# Altium project jtag_ob.PrjPcb
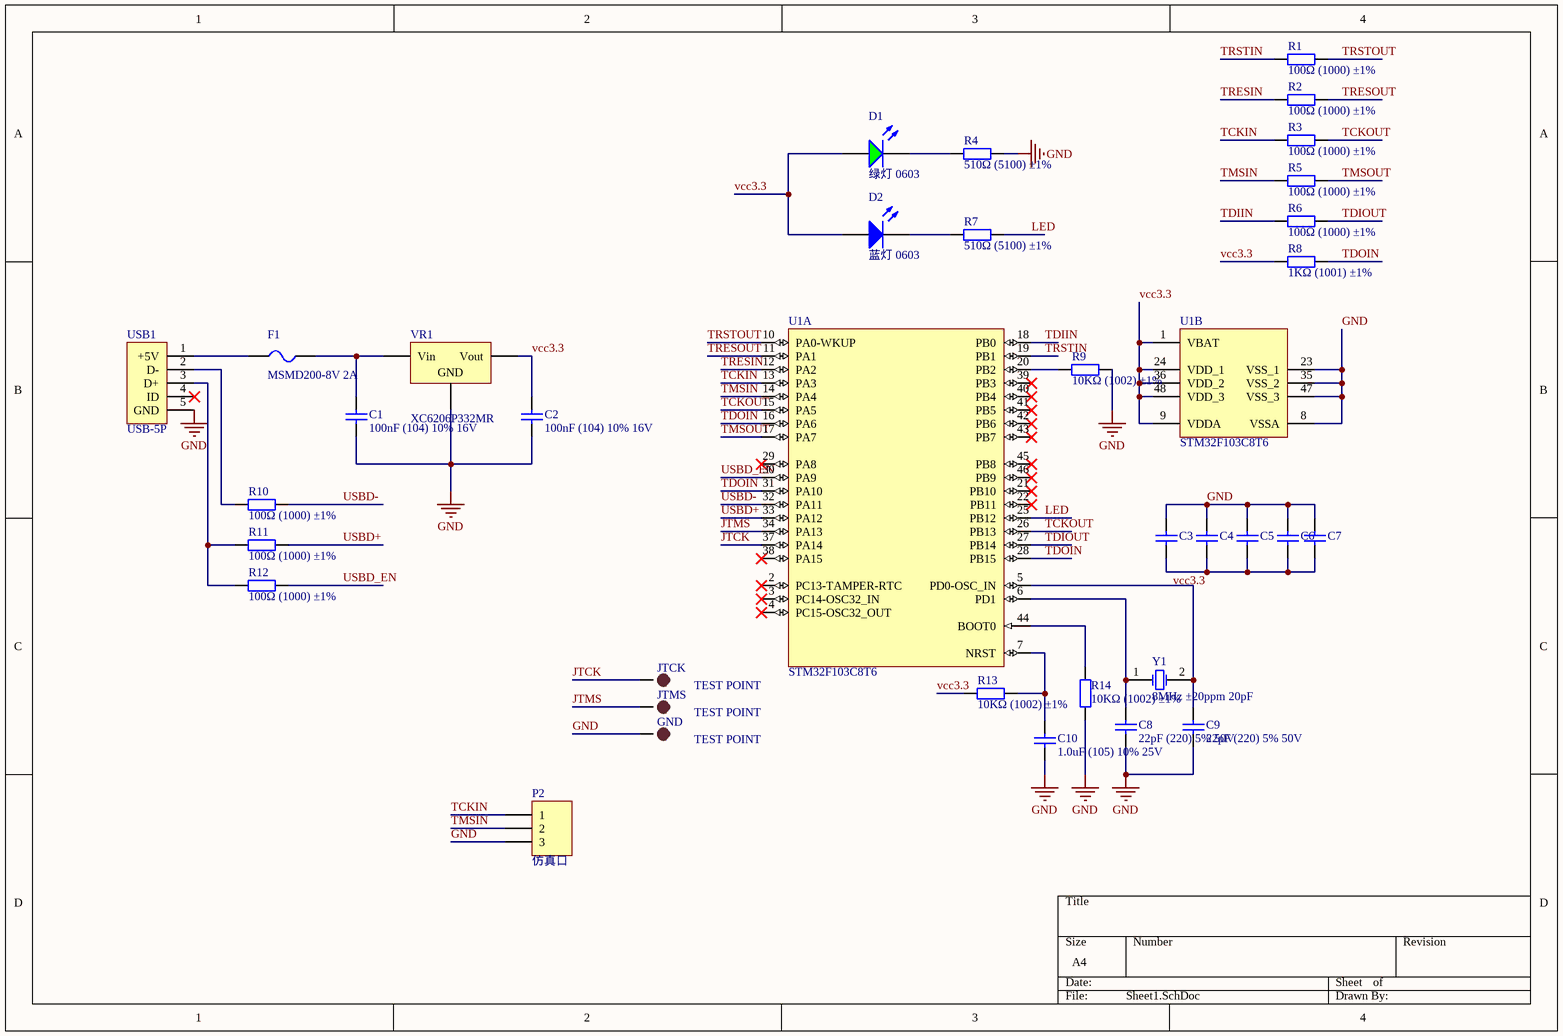
[diagram p0: Sheet1.SchDoc]
1 sheet, 35 parts. Net scope: global (net labels, ports and power ports of the same name join across sheets).
Board files: PCB1.PcbDoc, jlink_ob.PcbDoc

## Sheet Sheet1.SchDoc
size A4

### Parts
C1  100nF (104) 10% 16V  [0402_C]
C2  100nF (104) 10% 16V  [0402_C]
C3  100nF (104) 10% 16V  [0402_C]  (value not drawn)
C4  100nF (104) 10% 16V  [0402_C]  (value not drawn)
C5  100nF (104) 10% 16V  [0402_C]  (value not drawn)
C6  100nF (104) 10% 16V  [0402_C]  (value not drawn)
C7  100nF (104) 10% 16V  [0402_C]  (value not drawn)
C8  22pF (220) 5% 50V  [0402_C]
C9  22pF (220) 5% 50V  [0402_C]
C10  1.0uF (105) 10% 25V  [0402_C]
D1  绿灯 0603  [0603_LED_S1]
D2  蓝灯 0603  [0603_LED_S1]
F1  MSMD200-8V 2A  [FU 0805]
GND  TEST POINT  [TP-1.5]
JTCK  TEST POINT  [TP-1.5]
JTMS  TEST POINT  [TP-1.5]
P2  仿真口  [HDR1X3]
R1  100Ω (1000) ±1%  [0402_R]
R2  100Ω (1000) ±1%  [0402_R]
R3  100Ω (1000) ±1%  [0402_R]
R4  510Ω (5100) ±1%  [0603_R]
R5  100Ω (1000) ±1%  [0402_R]
R6  100Ω (1000) ±1%  [0402_R]
R7  510Ω (5100) ±1%  [0603_R]
R8  1KΩ (1001) ±1%  [0402_R]
R9  10KΩ (1002) ±1%  [0402_R]
R10  100Ω (1000) ±1%  [0402_R]
R11  100Ω (1000) ±1%  [0402_R]
R12  100Ω (1000) ±1%  [0402_R]
R13  10KΩ (1002) ±1%  [0402_R]
R14  10KΩ (1002) ±1%  [0402_R]
U1  STM32F103C8T6  [LQFP-48_7x7x05P]  (parts A,B of 2)
USB1  USB-5P  [USB-MICRO_A]
VR1  XC6206P332MR  [SOT-23-3L]
Y1  8MHz ±20ppm 20pF  [SMD-5032_2P]

### Nets
GND: C1.1 C2.1 C3.2 C4.2 C5.2 C6.2 C7.2 C8.1 C9.1 C10.1 GND.1 P2.3 R4.2 R9.2 R14.1 U1.8(VSSA) U1.23(VSS_1) U1.35(VSS_2) U1.47(VSS_3) USB1.5(GND) VR1.1(GND)
JTCK: JTCK.1 U1.37(PA14)
JTMS: JTMS.1 U1.34(PA13)
LED: R7.2 U1.25(PB12)
TCKIN: P2.1 R3.1 U1.13(PA3)
TCKOUT: R3.2 U1.15(PA5) U1.26(PB13)
TDIIN: R6.1 U1.18(PB0)
TDIOUT: R6.2 U1.27(PB14)
TDOIN: R8.2 U1.16(PA6) U1.28(PB15) U1.31(PA10)
TMSIN: P2.2 R5.1 U1.14(PA4)
TMSOUT: R5.2 U1.17(PA7)
TRESIN: R2.1 U1.12(PA2)
TRESOUT: R2.2 U1.11(PA1)
TRSTIN: R1.1 U1.19(PB1)
TRSTOUT: R1.2 U1.10(PA0-WKUP)
USBD+: R11.2 U1.33(PA12)
USBD-: R10.2 U1.32(PA11)
USBD_EN: R12.2 U1.30(PA9)
vcc3.3: C2.2 C3.1 C4.1 C5.1 C6.1 C7.1 D1.A D2.A R8.1 R13.1 U1.1(VBAT) U1.9(VDDA) U1.24(VDD_1) U1.36(VDD_2) U1.48(VDD_3) VR1.2(Vout)
NetC1_2: C1.2 F1.2 VR1.3(Vin)
NetC8_2: C8.2 U1.6(PD1) Y1.1(OSC1)
NetC9_2: C9.2 U1.5(PD0-OSC_IN) Y1.2(OSC2)
NetC10_2: C10.2 R13.2 U1.7(NRST)
NetD1_K: D1.K R4.1
NetD2_K: D2.K R7.1
NetF1_1: F1.1 USB1.1(+5V)
NetR9_1: R9.1 U1.20(PB2)
NetR10_1: R10.1 USB1.2(D-)
NetR11_1: R11.1 R12.1 USB1.3(D+)
NetR14_2: R14.2 U1.44(BOOT0)

Not connected (* = marked no-connect by the designer): U1 2(PC13-TAMPER-RTC)* 3(PC14-OSC32_IN)* 4(PC15-OSC32_OUT)* 21(PB10)* 22(PB11)* 29(PA8)* 38(PA15)* 39(PB3)* 40(PB4)* 41(PB5)* 42(PB6)* 43(PB7)* 45(PB8)* 46(PB9)*; USB1 4(ID)*

### Library data of the parts
C1-C7 = 0402 100nF (104) 10% 16V: 贴片电容; ComponentLink1Description: 供应商链接; ComponentLink1URL: http://www.szlcsc.com/product/details_1877.html; Package: 0402; Supplier: LC; SuppliersPartNumber: C1525
C8 C9 = 0402 22pF (220) 5% 50V: 贴片电容; ComponentLink1Description: 供应商链接; ComponentLink1URL: http://www.szlcsc.com/product/details_1907.html; Package: 0402; Supplier: LC; SuppliersPartNumber: C1555
C10 = 0402 1.0uF (105) 10% 25V: 贴片电容; ComponentLink1Description: 供应商链接; ComponentLink1URL: http://www.szlcsc.com/product/details_53938.html; Package: 0402; Supplier: LC; SuppliersPartNumber: C52923
D1 = 0603 绿灯: 发光二极管; ComponentLink1Description: 供应商链接; ComponentLink1URL: http://www.szlcsc.com/product/details_73152.html; Package: 0603; Supplier: LC; SuppliersPartNumber: C72043
D2 = 0603 蓝灯: 发光二极管; ComponentLink1Description: 供应商链接; ComponentLink1URL: http://www.szlcsc.com/product/details_73150.html; Package: 0603; Supplier: LC; SuppliersPartNumber: C72041
F1 = FU: 贴片保险丝; 版权归属: 源创客; BOM名称: 贴片保险丝; 学习资源: www.ooocke.com
GND JTCK JTMS = TEST-POINT: 测试点
P2 = Header 3: Header, 3-Pin; LatestRevisionDate: 17-Jul-2002; LatestRevisionNote: Re-released for DXP Platform.; Publisher: Altium Limited
R1-R3 R5 R6 R10-R12 = 0402 100Ω (1000) 1%: 贴片电阻; ComponentLink1Description: 供应商链接; ComponentLink1URL: http://www.szlcsc.com/product/details_25819.html; Package: 0402; Supplier: LC; SuppliersPartNumber: C25076
R4 R7 = 0603 510Ω (5100) 1%: 贴片电阻; ComponentLink1Description: 供应商链接; ComponentLink1URL: http://www.szlcsc.com/product/details_23920.html; Package: 0603; Supplier: LC; SuppliersPartNumber: C23193
R8 = 0402 1KΩ (1001) 1%: 贴片电阻; ComponentLink1Description: 供应商链接; ComponentLink1URL: http://www.szlcsc.com/product/details_12256.html; Package: 0402; Supplier: LC; SuppliersPartNumber: C11702
R9 R13 R14 = 0402 10KΩ (1002) 1%: 贴片电阻; ComponentLink1Description: 供应商链接; ComponentLink1URL: http://www.szlcsc.com/product/details_26487.html; Package: 0402; Supplier: LC; SuppliersPartNumber: C25744
U1 = STM32F103C8T6: ARM; ComponentLink1Description: 供应商链接; ComponentLink1URL: http://www.szlcsc.com/product/details_9243.html; Package: LQFP-48_7x7x05P; Supplier: LC; SuppliersPartNumber: C8734
USB1 = USB-5P: 微型USB母座; 版权归属: 源创客; BOM名称: 微型USB母座; 学习资源: www.ooocke.com
VR1 = SOT-23 XC6206P332MR: 低压差线性稳压(LDO); ComponentLink1Description: 供应商链接; ComponentLink1URL: http://www.szlcsc.com/product/details_5896.html; Package: SOT-23; Supplier: LC; SuppliersPartNumber: C5446
Y1 = SMD-5032_2P 8MHz 20ppm 20pF: 贴片晶振; ComponentLink1Description: 供应商链接; ComponentLink1URL: http://www.szlcsc.com/product/details_117214.html; Package: SMD-5032_2P; Supplier: LC; SuppliersPartNumber: C115962